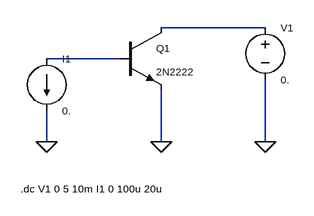
[diagram p0: schematic H3 - dari materi.asc]
H3 - dari materi.asc, the LTspice schematic file:
Version 4
SHEET 1 880 680
WIRE 432 112 272 112
WIRE 208 160 96 160
WIRE 96 288 96 240
WIRE 272 288 272 208
WIRE 432 288 432 192
FLAG 272 288 0
FLAG 432 288 0
FLAG 96 288 0
SYMBOL npn 208 112 R0
WINDOW 0 56 32 Left 1
WINDOW 3 56 68 Left 1
SYMATTR InstName Q1
SYMATTR Value 2N2222
SYMBOL voltage 432 96 R0
WINDOW 0 24 16 Left 1
WINDOW 3 24 96 Left 1
SYMATTR InstName V1
SYMATTR Value 0.
SYMBOL current 96 160 R0
WINDOW 0 24 0 Left 1
WINDOW 3 24 80 Left 1
WINDOW 123 0 0 Left 0
WINDOW 39 0 0 Left 0
SYMATTR InstName I1
SYMATTR Value 0.
TEXT 56 360 Left 1 !.dc V1 0 5 10m I1 0 100u 20u

The netlist it stands for:
* H3 - dari materi.asc
Q1 N001 N002 0 0 2N2222
V1 N001 0 0.
I1 N002 0 0.
.model NPN NPN
.model PNP PNP
.lib standard.bjt
.dc V1 0 5 10m I1 0 100u 20u
.backanno
.end